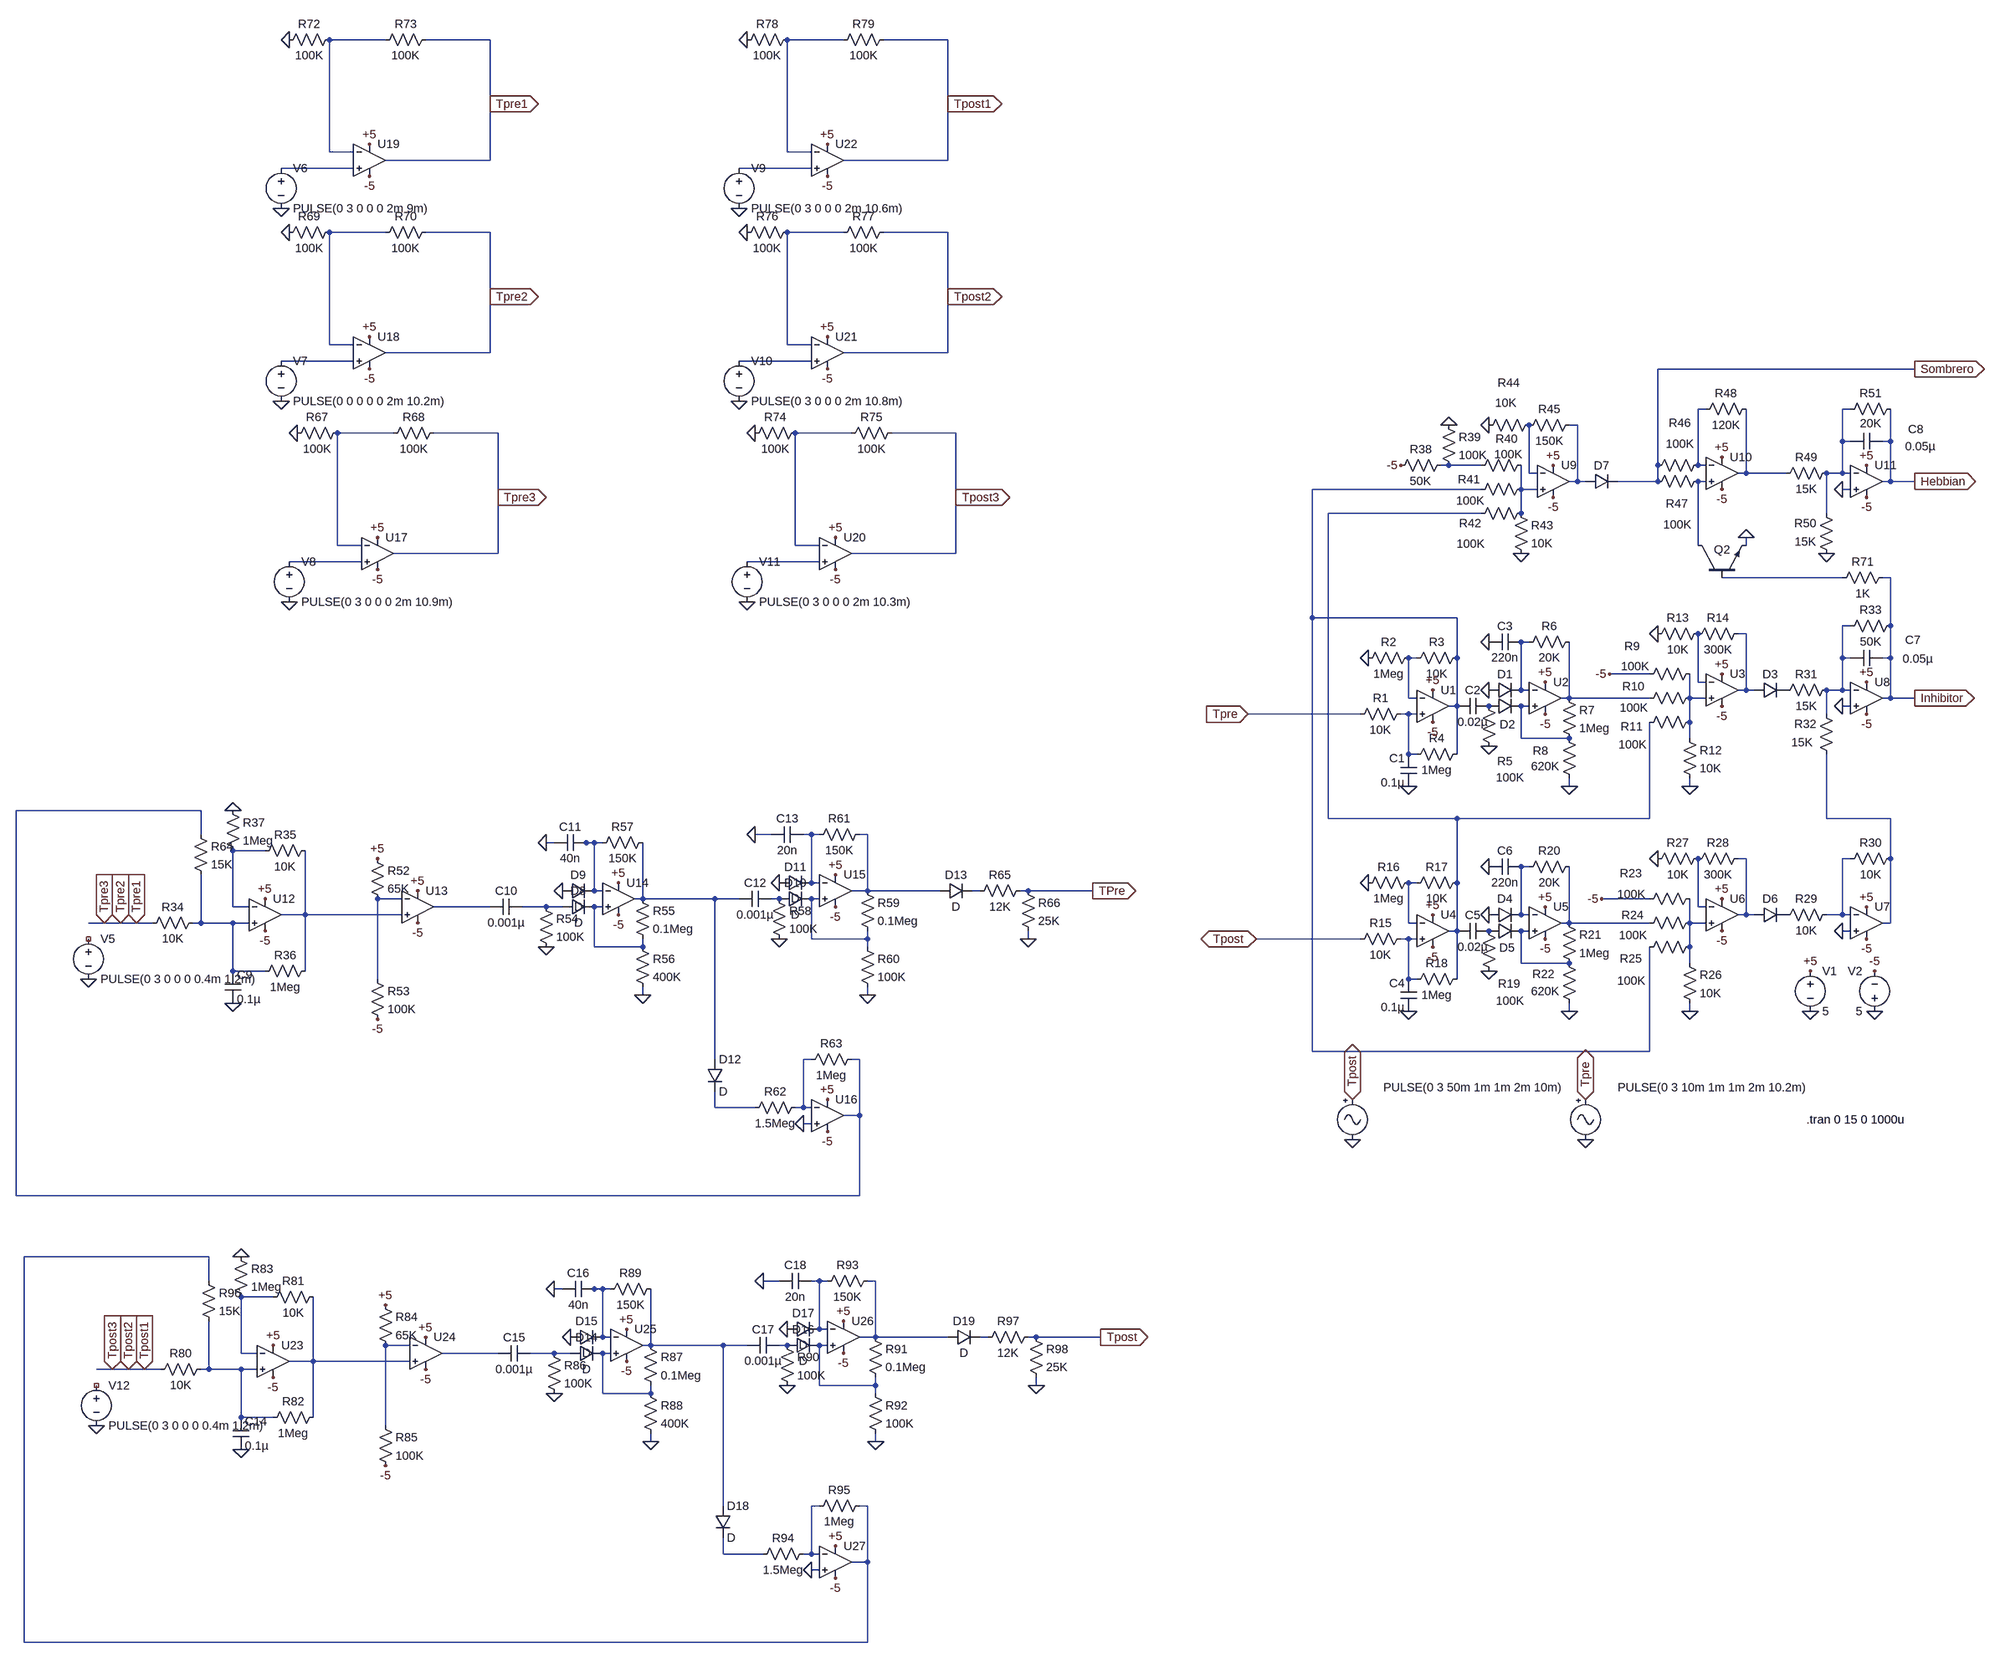
[diagram p0: schematic Last-3e_COMMON.asc]
Last-3e_COMMON.asc, the LTspice schematic file:
Version 4
SHEET 1 2784 1988
WIRE -2000 -1328 -2112 -1328
WIRE -1792 -1328 -1920 -1328
WIRE -1088 -1328 -1200 -1328
WIRE -880 -1328 -1008 -1328
WIRE -1792 -1200 -1792 -1328
WIRE -880 -1200 -880 -1328
WIRE -2112 -1104 -2112 -1328
WIRE -2064 -1104 -2112 -1104
WIRE -1200 -1104 -1200 -1328
WIRE -1152 -1104 -1200 -1104
WIRE -1792 -1088 -1792 -1200
WIRE -1792 -1088 -2000 -1088
WIRE -880 -1088 -880 -1200
WIRE -880 -1088 -1088 -1088
WIRE -2064 -1072 -2208 -1072
WIRE -1152 -1072 -1296 -1072
WIRE -2000 -944 -2112 -944
WIRE -1792 -944 -1920 -944
WIRE -1088 -944 -1200 -944
WIRE -880 -944 -1008 -944
WIRE -1792 -816 -1792 -944
WIRE -880 -816 -880 -944
WIRE -2112 -720 -2112 -944
WIRE -2064 -720 -2112 -720
WIRE -1200 -720 -1200 -944
WIRE -1152 -720 -1200 -720
WIRE -1792 -704 -1792 -816
WIRE -1792 -704 -2000 -704
WIRE -880 -704 -880 -816
WIRE -880 -704 -1088 -704
WIRE -2064 -688 -2208 -688
WIRE -1152 -688 -1296 -688
WIRE 1184 -672 672 -672
WIRE 768 -592 752 -592
WIRE 1056 -592 1040 -592
WIRE 512 -560 496 -560
WIRE -1984 -544 -2096 -544
WIRE -1776 -544 -1904 -544
WIRE -1072 -544 -1184 -544
WIRE -864 -544 -992 -544
WIRE 1040 -528 1040 -592
WIRE 1056 -528 1040 -528
WIRE 1136 -528 1136 -592
WIRE 1136 -528 1120 -528
WIRE 256 -480 240 -480
WIRE 320 -480 256 -480
WIRE 672 -480 672 -672
WIRE 752 -480 752 -592
WIRE 768 -480 752 -480
WIRE 416 -464 416 -560
WIRE 432 -464 416 -464
WIRE 848 -464 848 -592
WIRE 848 -464 832 -464
WIRE 928 -464 848 -464
WIRE 1040 -464 1040 -528
WIRE 1040 -464 1008 -464
WIRE 1056 -464 1040 -464
WIRE 512 -448 512 -560
WIRE 512 -448 496 -448
WIRE 528 -448 512 -448
WIRE 672 -448 672 -480
WIRE 672 -448 592 -448
WIRE 768 -448 752 -448
WIRE 1136 -448 1136 -528
WIRE 1136 -448 1120 -448
WIRE 1184 -448 1136 -448
WIRE 320 -432 -16 -432
WIRE 400 -432 400 -480
WIRE 432 -432 400 -432
WIRE 1056 -432 1040 -432
WIRE -1776 -416 -1776 -544
WIRE -864 -416 -864 -544
WIRE 320 -384 16 -384
WIRE 400 -384 400 -432
WIRE 1008 -384 1008 -464
WIRE -2096 -320 -2096 -544
WIRE -2048 -320 -2096 -320
WIRE -1184 -320 -1184 -544
WIRE -1136 -320 -1184 -320
WIRE 752 -320 752 -448
WIRE 848 -320 848 -336
WIRE -1776 -304 -1776 -416
WIRE -1776 -304 -1984 -304
WIRE -864 -304 -864 -416
WIRE -864 -304 -1072 -304
WIRE -2048 -288 -2192 -288
WIRE -1136 -288 -1280 -288
WIRE 1040 -256 800 -256
WIRE 1136 -256 1120 -256
WIRE -16 -176 -16 -432
WIRE 272 -176 -16 -176
WIRE 1056 -160 1040 -160
WIRE 1136 -160 1136 -256
WIRE 848 -144 832 -144
WIRE 416 -128 400 -128
WIRE 192 -96 176 -96
WIRE 272 -96 272 -176
WIRE 1040 -96 1040 -160
WIRE 1056 -96 1040 -96
WIRE 1136 -96 1136 -160
WIRE 1136 -96 1120 -96
WIRE 656 -64 576 -64
WIRE 752 -48 752 -144
WIRE 768 -48 752 -48
WIRE 400 -32 400 -128
WIRE 416 -32 400 -32
WIRE 848 -32 848 -144
WIRE 848 -32 832 -32
WIRE 864 -32 848 -32
WIRE 1040 -32 1040 -96
WIRE 1040 -32 1008 -32
WIRE 1056 -32 1040 -32
WIRE 176 -16 176 -96
WIRE 192 -16 176 -16
WIRE 496 -16 496 -128
WIRE 496 -16 480 -16
WIRE 656 -16 496 -16
WIRE 736 -16 736 -64
WIRE 768 -16 736 -16
WIRE 1136 -16 1136 -96
WIRE 1136 -16 1120 -16
WIRE 1184 -16 1136 -16
WIRE 272 0 272 -96
WIRE 272 0 256 0
WIRE 416 0 400 0
WIRE 1056 0 1040 0
WIRE 80 16 -224 16
WIRE 176 16 160 16
WIRE 192 16 176 16
WIRE 1008 16 1008 -32
WIRE 736 32 736 -16
WIRE 400 64 400 0
WIRE 496 64 400 64
WIRE 736 64 736 32
WIRE 176 96 176 16
WIRE 192 96 176 96
WIRE 272 96 272 0
WIRE 496 160 496 144
WIRE 736 160 736 144
WIRE -2368 208 -2736 208
WIRE 16 224 16 -384
WIRE 272 224 16 224
WIRE 656 224 656 32
WIRE 656 224 272 224
WIRE 1008 224 1008 96
WIRE 1136 224 1008 224
WIRE -2368 256 -2368 208
WIRE -1232 256 -1264 256
WIRE -1152 256 -1168 256
WIRE -1136 256 -1152 256
WIRE -1040 256 -1056 256
WIRE -1664 272 -1680 272
WIRE -1600 272 -1616 272
WIRE -1584 272 -1600 272
WIRE -1568 272 -1584 272
WIRE -2240 288 -2304 288
WIRE 848 304 832 304
WIRE 1056 304 1040 304
WIRE 1136 304 1136 224
WIRE 416 320 400 320
WIRE -1152 352 -1152 256
WIRE -1136 352 -1152 352
WIRE 192 352 176 352
WIRE 272 352 272 224
WIRE -1584 368 -1584 272
WIRE -1568 368 -1584 368
WIRE -1040 368 -1040 256
WIRE -1040 368 -1072 368
WIRE -896 368 -1040 368
WIRE -816 368 -832 368
WIRE -720 368 -736 368
WIRE -592 368 -720 368
WIRE -1968 384 -2016 384
WIRE -1488 384 -1488 272
WIRE -1488 384 -1504 384
WIRE -1344 384 -1488 384
WIRE -1296 384 -1344 384
WIRE -1216 384 -1232 384
WIRE -1136 384 -1152 384
WIRE 656 384 560 384
WIRE -2304 400 -2304 288
WIRE -2272 400 -2304 400
WIRE -1792 400 -1904 400
WIRE -1680 400 -1728 400
WIRE -1648 400 -1680 400
WIRE -1568 400 -1584 400
WIRE 752 400 752 304
WIRE 768 400 752 400
WIRE -2160 416 -2160 288
WIRE -2160 416 -2208 416
WIRE -1968 416 -2160 416
WIRE 400 416 400 320
WIRE 416 416 400 416
WIRE 848 416 848 304
WIRE 848 416 832 416
WIRE 864 416 848 416
WIRE 1040 416 1040 304
WIRE 1040 416 1008 416
WIRE 1056 416 1040 416
WIRE -2560 432 -2592 432
WIRE -2528 432 -2560 432
WIRE -2496 432 -2528 432
WIRE -2464 432 -2496 432
WIRE -2368 432 -2368 336
WIRE -2368 432 -2384 432
WIRE -2304 432 -2368 432
WIRE -2272 432 -2304 432
WIRE 176 432 176 352
WIRE 192 432 176 432
WIRE 496 432 496 320
WIRE 496 432 480 432
WIRE 656 432 496 432
WIRE 736 432 736 384
WIRE 768 432 736 432
WIRE 1136 432 1136 304
WIRE 1136 432 1120 432
WIRE 272 448 272 352
WIRE 272 448 256 448
WIRE 416 448 400 448
WIRE 1056 448 1040 448
WIRE -1152 464 -1152 384
WIRE -1040 464 -1040 448
WIRE -1040 464 -1152 464
WIRE -720 464 -720 448
WIRE 80 464 -208 464
WIRE 176 464 160 464
WIRE 192 464 176 464
WIRE -1584 480 -1584 400
WIRE -1488 480 -1488 464
WIRE -1488 480 -1584 480
WIRE -1040 480 -1040 464
WIRE 736 480 736 432
WIRE 400 512 400 448
WIRE 496 512 400 512
WIRE 736 512 736 480
WIRE -2304 528 -2304 432
WIRE -2240 528 -2304 528
WIRE -2160 528 -2160 416
WIRE -2016 544 -2016 384
WIRE 176 544 176 464
WIRE 192 544 176 544
WIRE 272 544 272 448
WIRE -1488 576 -1488 560
WIRE -1040 576 -1040 560
WIRE 496 608 496 592
WIRE 736 608 736 592
WIRE -16 688 -16 -176
WIRE 656 688 656 480
WIRE 656 688 -16 688
WIRE -1344 704 -1344 384
WIRE -1152 704 -1168 704
WIRE -1056 704 -1072 704
WIRE -1344 800 -1344 768
WIRE -1264 800 -1344 800
WIRE -1168 800 -1168 704
WIRE -1168 800 -1184 800
WIRE -1152 800 -1168 800
WIRE -1056 816 -1056 704
WIRE -1056 816 -1088 816
WIRE -1152 832 -1168 832
WIRE -2736 976 -2736 208
WIRE -1056 976 -1056 816
WIRE -1056 976 -2736 976
WIRE -2352 1216 -2720 1216
WIRE -2352 1264 -2352 1216
WIRE -1216 1264 -1248 1264
WIRE -1136 1264 -1152 1264
WIRE -1120 1264 -1136 1264
WIRE -1024 1264 -1040 1264
WIRE -1648 1280 -1664 1280
WIRE -1584 1280 -1600 1280
WIRE -1568 1280 -1584 1280
WIRE -1552 1280 -1568 1280
WIRE -2224 1296 -2288 1296
WIRE -1136 1360 -1136 1264
WIRE -1120 1360 -1136 1360
WIRE -1568 1376 -1568 1280
WIRE -1552 1376 -1568 1376
WIRE -1024 1376 -1024 1264
WIRE -1024 1376 -1056 1376
WIRE -880 1376 -1024 1376
WIRE -800 1376 -816 1376
WIRE -704 1376 -720 1376
WIRE -576 1376 -704 1376
WIRE -1952 1392 -2000 1392
WIRE -1472 1392 -1472 1280
WIRE -1472 1392 -1488 1392
WIRE -1328 1392 -1472 1392
WIRE -1280 1392 -1328 1392
WIRE -1200 1392 -1216 1392
WIRE -1120 1392 -1136 1392
WIRE -2288 1408 -2288 1296
WIRE -2256 1408 -2288 1408
WIRE -1776 1408 -1888 1408
WIRE -1664 1408 -1712 1408
WIRE -1632 1408 -1664 1408
WIRE -1552 1408 -1568 1408
WIRE -2144 1424 -2144 1296
WIRE -2144 1424 -2192 1424
WIRE -1952 1424 -2144 1424
WIRE -2544 1440 -2576 1440
WIRE -2512 1440 -2544 1440
WIRE -2480 1440 -2512 1440
WIRE -2448 1440 -2480 1440
WIRE -2352 1440 -2352 1344
WIRE -2352 1440 -2368 1440
WIRE -2288 1440 -2352 1440
WIRE -2256 1440 -2288 1440
WIRE -1136 1472 -1136 1392
WIRE -1024 1472 -1024 1456
WIRE -1024 1472 -1136 1472
WIRE -704 1472 -704 1456
WIRE -1568 1488 -1568 1408
WIRE -1472 1488 -1472 1472
WIRE -1472 1488 -1568 1488
WIRE -1024 1488 -1024 1472
WIRE -2288 1536 -2288 1440
WIRE -2224 1536 -2288 1536
WIRE -2144 1536 -2144 1424
WIRE -2000 1552 -2000 1392
WIRE -1472 1584 -1472 1568
WIRE -1024 1584 -1024 1568
WIRE -1328 1712 -1328 1392
WIRE -1136 1712 -1152 1712
WIRE -1040 1712 -1056 1712
WIRE -1328 1808 -1328 1776
WIRE -1248 1808 -1328 1808
WIRE -1152 1808 -1152 1712
WIRE -1152 1808 -1168 1808
WIRE -1136 1808 -1152 1808
WIRE -1040 1824 -1040 1712
WIRE -1040 1824 -1072 1824
WIRE -1136 1840 -1152 1840
WIRE -2720 1984 -2720 1216
WIRE -1040 1984 -1040 1824
WIRE -1040 1984 -2720 1984
FLAG 800 -64 +5
FLAG 800 0 -5
FLAG 528 864 0
FLAG 64 864 0
FLAG 224 -32 +5
FLAG 224 32 -5
FLAG 448 -48 +5
FLAG 448 16 -5
FLAG 336 -32 0
FLAG 336 -128 0
FLAG 336 80 0
FLAG 672 -144 0
FLAG 576 -64 -5
FLAG 448 400 +5
FLAG 448 464 -5
FLAG 336 416 0
FLAG 336 320 0
FLAG 336 528 0
FLAG 496 608 0
FLAG 496 160 0
FLAG 800 384 +5
FLAG 800 448 -5
FLAG 672 304 0
FLAG 560 384 -5
FLAG 176 160 0
FLAG 96 -96 0
FLAG 224 416 +5
FLAG 224 480 -5
FLAG 176 608 0
FLAG 96 352 0
FLAG 1088 -48 +5
FLAG 1088 16 -5
FLAG 1088 400 +5
FLAG 1088 464 -5
FLAG 1040 448 0
FLAG 1040 0 0
FLAG 736 160 0
FLAG 736 608 0
FLAG 1184 -16 Inhibitor
IOPIN 1184 -16 Out
FLAG 464 -480 +5
FLAG 464 -416 -5
FLAG 336 -560 0
FLAG 256 -560 0
FLAG 800 -496 +5
FLAG 800 -432 -5
FLAG 160 -480 -5
FLAG 1088 -480 +5
FLAG 1088 -416 -5
FLAG 1040 -432 0
FLAG 1008 -304 0
FLAG 848 -336 0
FLAG 1184 -448 Hebbian
IOPIN 1184 -448 Out
FLAG 1184 -672 Sombrero
IOPIN 1184 -672 Out
FLAG 976 608 0
FLAG 1104 608 0
FLAG 1104 528 -5
FLAG 976 528 +5
FLAG -208 464 Tpost
IOPIN -208 464 BiDir
FLAG 64 784 Tpost
IOPIN 64 784 BiDir
FLAG 528 784 Tpre
IOPIN 528 784 BiDir
FLAG 400 -304 0
FLAG -2304 208 0
FLAG -2304 592 0
FLAG -1680 480 0
FLAG -1488 576 0
FLAG -1680 272 0
FLAG -1648 368 0
FLAG -1216 464 0
FLAG -1040 576 0
FLAG -1264 256 0
FLAG -1216 352 0
FLAG -1168 832 0
FLAG -2592 544 0
FLAG -2240 384 +5
FLAG -1936 368 +5
FLAG -1536 352 +5
FLAG -1104 336 +5
FLAG -1120 784 +5
FLAG -720 464 0
FLAG -592 368 TPre
IOPIN -592 368 Out
FLAG -1936 432 -5
FLAG -2240 448 -5
FLAG -1536 416 -5
FLAG -1104 400 -5
FLAG -1120 848 -5
FLAG -2016 624 -5
FLAG -2016 304 +5
FLAG -2016 -336 +5
FLAG -2016 -272 -5
FLAG -2176 -544 0
FLAG -1776 -416 Tpre3
IOPIN -1776 -416 Out
FLAG -2032 -736 +5
FLAG -2032 -672 -5
FLAG -2192 -944 0
FLAG -1792 -816 Tpre2
IOPIN -1792 -816 Out
FLAG -2032 -1120 +5
FLAG -2032 -1056 -5
FLAG -2192 -1328 0
FLAG -1792 -1200 Tpre1
IOPIN -1792 -1200 Out
FLAG -2528 432 Tpre2
IOPIN -2528 432 In
FLAG -2496 432 Tpre1
IOPIN -2496 432 In
FLAG -2560 432 Tpre3
IOPIN -2560 432 In
FLAG -224 16 Tpre
IOPIN -224 16 In
FLAG -1104 -336 +5
FLAG -1104 -272 -5
FLAG -1264 -544 0
FLAG -864 -416 Tpost3
IOPIN -864 -416 Out
FLAG -1120 -736 +5
FLAG -1120 -672 -5
FLAG -1280 -944 0
FLAG -880 -816 Tpost2
IOPIN -880 -816 Out
FLAG -1120 -1120 +5
FLAG -1120 -1056 -5
FLAG -1280 -1328 0
FLAG -880 -1200 Tpost1
IOPIN -880 -1200 Out
FLAG -2544 1440 Tpost3
IOPIN -2544 1440 In
FLAG -2512 1440 Tpost2
IOPIN -2512 1440 In
FLAG -2480 1440 Tpost1
IOPIN -2480 1440 In
FLAG -2208 -992 0
FLAG -2208 -608 0
FLAG -2192 -208 0
FLAG -1296 -992 0
FLAG -1296 -608 0
FLAG -1280 -208 0
FLAG -2288 1216 0
FLAG -2288 1600 0
FLAG -1664 1488 0
FLAG -1472 1584 0
FLAG -1664 1280 0
FLAG -1632 1376 0
FLAG -1200 1472 0
FLAG -1024 1584 0
FLAG -1248 1264 0
FLAG -1200 1360 0
FLAG -1152 1840 0
FLAG -2576 1552 0
FLAG -2224 1392 +5
FLAG -1920 1376 +5
FLAG -1520 1360 +5
FLAG -1088 1344 +5
FLAG -1104 1792 +5
FLAG -704 1472 0
FLAG -576 1376 Tpost
IOPIN -576 1376 Out
FLAG -1920 1440 -5
FLAG -2224 1456 -5
FLAG -1520 1424 -5
FLAG -1088 1408 -5
FLAG -1104 1856 -5
FLAG -2000 1632 -5
FLAG -2000 1312 +5
SYMBOL Opamps\\UniversalOpamp2 800 -32 R0
SYMATTR InstName U3
SYMBOL res 848 -160 R90
WINDOW 0 0 56 VBottom 2
WINDOW 3 32 56 VTop 2
SYMATTR InstName R14
SYMATTR Value 300K
SYMBOL res 720 48 R0
SYMATTR InstName R12
SYMATTR Value 10K
SYMBOL res 752 -32 R90
WINDOW 0 8 128 VBottom 2
WINDOW 3 20 127 VTop 2
SYMATTR InstName R10
SYMATTR Value 100K
SYMBOL Opamps\\UniversalOpamp2 224 0 R0
SYMATTR InstName U1
SYMBOL cap 192 160 R180
WINDOW 0 24 56 Left 2
WINDOW 3 24 8 Left 2
SYMATTR InstName C1
SYMATTR Value 0.1µ
SYMBOL res 176 0 R90
WINDOW 0 0 56 VBottom 2
WINDOW 3 32 56 VTop 2
SYMATTR InstName R1
SYMATTR Value 10K
SYMBOL res 176 448 R90
WINDOW 0 0 56 VBottom 2
WINDOW 3 32 56 VTop 2
SYMATTR InstName R15
SYMATTR Value 10K
SYMBOL res 288 -112 R90
WINDOW 0 0 56 VBottom 2
WINDOW 3 32 56 VTop 2
SYMATTR InstName R3
SYMATTR Value 10K
SYMBOL res 752 16 R90
WINDOW 0 40 132 VBottom 2
WINDOW 3 45 130 VTop 2
SYMATTR InstName R11
SYMATTR Value 100K
SYMBOL Opamps\\UniversalOpamp2 448 -16 R0
SYMATTR InstName U2
SYMBOL diode 336 -16 R270
WINDOW 0 32 32 VTop 2
WINDOW 3 0 32 Invisible 2
SYMATTR InstName D1
SYMBOL diode 336 16 R270
WINDOW 0 -36 37 VTop 2
WINDOW 3 0 32 Invisible 2
SYMATTR InstName D2
SYMBOL res 480 -32 R0
SYMATTR InstName R7
SYMATTR Value 1Meg
SYMBOL res 512 160 R180
WINDOW 0 58 71 Left 2
WINDOW 3 36 40 Left 2
SYMATTR InstName R8
SYMATTR Value 620K
SYMBOL res 320 -16 R0
WINDOW 0 32 126 Left 2
WINDOW 3 30 158 Left 2
SYMATTR InstName R5
SYMATTR Value 100K
SYMBOL cap 336 -16 R90
WINDOW 0 0 32 VBottom 2
WINDOW 3 32 32 VTop 2
SYMATTR InstName C2
SYMATTR Value 0.02µ
SYMBOL res 512 -144 R90
WINDOW 0 0 56 VBottom 2
WINDOW 3 32 56 VTop 2
SYMATTR InstName R6
SYMATTR Value 20K
SYMBOL cap 400 -144 R90
WINDOW 0 0 32 VBottom 2
WINDOW 3 32 32 VTop 2
SYMATTR InstName C3
SYMATTR Value 220n
SYMBOL res 656 -128 R270
WINDOW 0 32 56 VTop 2
WINDOW 3 0 56 VBottom 2
SYMATTR InstName R13
SYMATTR Value 10K
SYMBOL diode 864 -16 R270
WINDOW 0 32 32 VTop 2
WINDOW 3 0 32 Invisible 2
SYMATTR InstName D3
SYMBOL res 752 -80 R90
WINDOW 0 -24 131 VBottom 2
WINDOW 3 -15 125 VTop 2
SYMATTR InstName R9
SYMATTR Value 100K
SYMBOL Opamps\\UniversalOpamp2 448 432 R0
SYMATTR InstName U5
SYMBOL diode 336 432 R270
WINDOW 0 32 32 VTop 2
WINDOW 3 0 32 Invisible 2
SYMATTR InstName D4
SYMBOL diode 336 464 R270
WINDOW 0 -33 36 VTop 2
WINDOW 3 0 32 Invisible 2
SYMATTR InstName D5
SYMBOL res 480 416 R0
SYMATTR InstName R21
SYMATTR Value 1Meg
SYMBOL res 512 608 R180
WINDOW 0 45 74 Left 2
WINDOW 3 36 40 Left 2
SYMATTR InstName R22
SYMATTR Value 620K
SYMBOL res 320 432 R0
WINDOW 0 34 121 Left 2
WINDOW 3 30 155 Left 2
SYMATTR InstName R19
SYMATTR Value 100K
SYMBOL res 512 304 R90
WINDOW 0 0 56 VBottom 2
WINDOW 3 32 56 VTop 2
SYMATTR InstName R20
SYMATTR Value 20K
SYMBOL cap 400 304 R90
WINDOW 0 0 32 VBottom 2
WINDOW 3 32 32 VTop 2
SYMATTR InstName C6
SYMATTR Value 220n
SYMBOL cap 336 432 R90
WINDOW 0 0 32 VBottom 2
WINDOW 3 32 32 VTop 2
SYMATTR InstName C5
SYMATTR Value 0.02µ
SYMBOL Opamps\\UniversalOpamp2 800 416 R0
SYMATTR InstName U6
SYMBOL res 848 288 R90
WINDOW 0 0 56 VBottom 2
WINDOW 3 32 56 VTop 2
SYMATTR InstName R28
SYMATTR Value 300K
SYMBOL res 720 496 R0
SYMATTR InstName R26
SYMATTR Value 10K
SYMBOL res 752 416 R90
WINDOW 0 16 130 VBottom 2
WINDOW 3 25 129 VTop 2
SYMATTR InstName R24
SYMATTR Value 100K
SYMBOL res 752 464 R90
WINDOW 0 55 133 VBottom 2
WINDOW 3 68 132 VTop 2
SYMATTR InstName R25
SYMATTR Value 100K
SYMBOL res 656 320 R270
WINDOW 0 32 56 VTop 2
WINDOW 3 0 56 VBottom 2
SYMATTR InstName R27
SYMATTR Value 10K
SYMBOL diode 864 432 R270
WINDOW 0 32 32 VTop 2
WINDOW 3 0 32 Invisible 2
SYMATTR InstName D6
SYMBOL res 752 368 R90
WINDOW 0 -19 133 VBottom 2
WINDOW 3 -9 132 VTop 2
SYMATTR InstName R23
SYMATTR Value 100K
SYMBOL res 1152 -176 R90
WINDOW 0 0 56 VBottom 2
WINDOW 3 32 56 VTop 2
SYMATTR InstName R33
SYMATTR Value 50K
SYMBOL res 1024 -48 R90
WINDOW 0 0 56 VBottom 2
WINDOW 3 32 56 VTop 2
SYMATTR InstName R31
SYMATTR Value 15K
SYMBOL res 1024 112 R180
WINDOW 0 36 76 Left 2
WINDOW 3 43 40 Left 2
SYMATTR InstName R32
SYMATTR Value 15K
SYMBOL res 288 80 R90
WINDOW 0 0 56 VBottom 2
WINDOW 3 32 56 VTop 2
SYMATTR InstName R4
SYMATTR Value 1Meg
SYMBOL res 192 -112 R90
WINDOW 0 0 56 VBottom 2
WINDOW 3 32 56 VTop 2
SYMATTR InstName R2
SYMATTR Value 1Meg
SYMBOL Opamps\\UniversalOpamp2 224 448 R0
SYMATTR InstName U4
SYMBOL cap 192 608 R180
WINDOW 0 24 56 Left 2
WINDOW 3 24 8 Left 2
SYMATTR InstName C4
SYMATTR Value 0.1µ
SYMBOL res 288 336 R90
WINDOW 0 0 56 VBottom 2
WINDOW 3 32 56 VTop 2
SYMATTR InstName R17
SYMATTR Value 10K
SYMBOL res 288 528 R90
WINDOW 0 0 56 VBottom 2
WINDOW 3 32 56 VTop 2
SYMATTR InstName R18
SYMATTR Value 1Meg
SYMBOL res 192 336 R90
WINDOW 0 0 56 VBottom 2
WINDOW 3 32 56 VTop 2
SYMATTR InstName R16
SYMATTR Value 1Meg
SYMBOL Opamps\\UniversalOpamp2 1088 -16 R0
SYMATTR InstName U8
SYMBOL res 1152 288 R90
WINDOW 0 0 56 VBottom 2
WINDOW 3 32 56 VTop 2
SYMATTR InstName R30
SYMATTR Value 10K
SYMBOL Opamps\\UniversalOpamp2 1088 432 R0
SYMATTR InstName U7
SYMBOL res 1024 400 R90
WINDOW 0 0 56 VBottom 2
WINDOW 3 32 56 VTop 2
SYMATTR InstName R29
SYMATTR Value 10K
SYMBOL cap 1120 -112 R90
WINDOW 0 -4 -60 VBottom 2
WINDOW 3 2 -70 VTop 2
SYMATTR InstName C7
SYMATTR Value 0.05µ
SYMBOL Opamps\\UniversalOpamp2 464 -448 R0
SYMATTR InstName U9
SYMBOL res 512 -576 R90
WINDOW 0 0 56 VBottom 2
WINDOW 3 32 56 VTop 2
SYMATTR InstName R45
SYMATTR Value 150K
SYMBOL res 384 -400 R0
SYMATTR InstName R43
SYMATTR Value 10K
SYMBOL res 416 -448 R90
WINDOW 0 12 120 VBottom 2
WINDOW 3 23 117 VTop 2
SYMATTR InstName R41
SYMATTR Value 100K
SYMBOL res 320 -544 R270
WINDOW 0 85 55 VTop 2
WINDOW 3 76 50 VBottom 2
SYMATTR InstName R44
SYMATTR Value 10K
SYMBOL res 416 -496 R90
WINDOW 0 -21 45 VBottom 2
WINDOW 3 -21 41 VTop 2
SYMATTR InstName R40
SYMATTR Value 100K
SYMBOL res 240 -576 R0
SYMATTR InstName R39
SYMATTR Value 100K
SYMBOL res 256 -496 R90
WINDOW 0 0 56 VBottom 2
WINDOW 3 32 56 VTop 2
SYMATTR InstName R38
SYMATTR Value 50K
SYMBOL diode 528 -432 R270
WINDOW 0 32 32 VTop 2
WINDOW 3 0 32 Invisible 2
SYMATTR InstName D7
SYMBOL res 864 -608 R90
WINDOW 0 0 56 VBottom 2
WINDOW 3 32 56 VTop 2
SYMATTR InstName R48
SYMATTR Value 120K
SYMBOL Opamps\\UniversalOpamp2 800 -464 R0
SYMATTR InstName U10
SYMBOL res 768 -496 R90
WINDOW 0 -53 52 VBottom 2
WINDOW 3 -42 52 VTop 2
SYMATTR InstName R46
SYMATTR Value 100K
SYMBOL res 768 -464 R90
WINDOW 0 76 58 VBottom 2
WINDOW 3 87 57 VTop 2
SYMATTR InstName R47
SYMATTR Value 100K
SYMBOL npn 752 -256 R270
WINDOW 0 56 32 VRight 2
WINDOW 3 56 68 Invisible 2
SYMATTR InstName Q2
SYMBOL res 1152 -608 R90
WINDOW 0 0 56 VBottom 2
WINDOW 3 60 56 VBottom 2
SYMATTR InstName R51
SYMATTR Value 20K
SYMBOL res 1024 -480 R90
WINDOW 0 0 56 VBottom 2
WINDOW 3 32 56 VTop 2
SYMATTR InstName R49
SYMATTR Value 15K
SYMBOL res 1024 -288 R180
WINDOW 0 36 76 Left 2
WINDOW 3 36 40 Left 2
SYMATTR InstName R50
SYMATTR Value 15K
SYMBOL Opamps\\UniversalOpamp2 1088 -448 R0
SYMATTR InstName U11
SYMBOL cap 1120 -544 R90
WINDOW 0 8 -66 VBottom 2
WINDOW 3 11 -75 VTop 2
SYMATTR InstName C8
SYMATTR Value 0.05µ
SYMBOL res 1024 -240 R270
WINDOW 0 32 56 VTop 2
WINDOW 3 0 56 VBottom 2
SYMATTR InstName R71
SYMATTR Value 1K
SYMBOL voltage 976 512 R0
WINDOW 123 0 0 Left 2
WINDOW 39 0 0 Left 2
SYMATTR InstName V1
SYMATTR Value 5
SYMBOL voltage 1104 624 R180
WINDOW 0 24 96 Left 2
WINDOW 3 24 16 Left 2
WINDOW 123 0 0 Left 2
WINDOW 39 0 0 Left 2
SYMATTR InstName V2
SYMATTR Value 5
SYMBOL Misc\\signal 64 768 R0
WINDOW 0 24 16 Invisible 2
WINDOW 3 62 -8 Left 2
WINDOW 123 0 0 Left 2
WINDOW 39 0 0 Left 2
SYMATTR InstName V3
SYMATTR Value PULSE(0 3 50m 1m 1m 2m 10m)
SYMBOL Misc\\signal 528 768 R0
WINDOW 0 24 16 Invisible 2
WINDOW 3 64 -8 Left 2
WINDOW 123 0 0 Left 2
WINDOW 39 0 0 Left 2
SYMATTR InstName V4
SYMATTR Value PULSE(0 3 10m 1m 1m 2m 10.2m)
SYMBOL res 416 -400 R90
WINDOW 0 51 117 VBottom 2
WINDOW 3 61 116 VTop 2
SYMATTR InstName R42
SYMATTR Value 100K
SYMBOL voltage -2592 448 R0
WINDOW 123 0 0 Left 0
WINDOW 39 0 0 Left 0
SYMATTR InstName V5
SYMATTR Value PULSE(0 3 0 0 0 0.4m 1.2m)
SYMBOL res -2368 416 R90
WINDOW 0 0 56 VBottom 2
WINDOW 3 32 56 VTop 2
SYMATTR InstName R34
SYMATTR Value 10K
SYMBOL Opamps\\UniversalOpamp2 -2240 416 R0
SYMATTR InstName U12
SYMBOL res -2144 272 R90
WINDOW 0 0 56 VBottom 2
WINDOW 3 32 56 VTop 2
SYMATTR InstName R35
SYMATTR Value 10K
SYMBOL res -2144 512 R90
WINDOW 0 0 56 VBottom 2
WINDOW 3 32 56 VTop 2
SYMATTR InstName R36
SYMATTR Value 1Meg
SYMBOL res -2320 192 R0
SYMATTR InstName R37
SYMATTR Value 1Meg
SYMBOL cap -2320 528 R0
SYMATTR InstName C9
SYMATTR Value 0.1µ
SYMBOL Opamps\\UniversalOpamp2 -1936 400 R0
SYMATTR InstName U13
SYMBOL res -2032 288 R0
SYMATTR InstName R52
SYMATTR Value 65K
SYMBOL res -2032 528 R0
SYMATTR InstName R53
SYMATTR Value 100K
SYMBOL cap -1728 384 R90
WINDOW 0 0 32 VBottom 2
WINDOW 3 32 32 VTop 2
SYMATTR InstName C10
SYMATTR Value 0.001µ
SYMBOL res -1696 384 R0
SYMATTR InstName R54
SYMATTR Value 100K
SYMBOL diode -1648 416 R270
WINDOW 0 32 32 VTop 2
WINDOW 3 0 32 VBottom 2
SYMATTR InstName D8
SYMBOL Opamps\\UniversalOpamp2 -1536 384 R0
SYMATTR InstName U14
SYMBOL res -1504 368 R0
SYMATTR InstName R55
SYMATTR Value 0.1Meg
SYMBOL res -1504 464 R0
SYMATTR InstName R56
SYMATTR Value 400K
SYMBOL res -1472 256 R90
WINDOW 0 0 56 VBottom 2
WINDOW 3 32 56 VTop 2
SYMATTR InstName R57
SYMATTR Value 150K
SYMBOL cap -1600 256 R90
WINDOW 0 0 32 VBottom 2
WINDOW 3 32 32 VTop 2
SYMATTR InstName C11
SYMATTR Value 40n
SYMBOL diode -1648 384 R270
WINDOW 0 32 32 VTop 2
WINDOW 3 0 32 VBottom 2
SYMATTR InstName D9
SYMBOL cap -1232 368 R90
WINDOW 0 0 32 VBottom 2
WINDOW 3 32 32 VTop 2
SYMATTR InstName C12
SYMATTR Value 0.001µ
SYMBOL diode -1216 400 R270
WINDOW 0 32 32 VTop 2
WINDOW 3 0 32 VBottom 2
SYMATTR InstName D10
SYMBOL res -1232 368 R0
SYMATTR InstName R58
SYMATTR Value 100K
SYMBOL Opamps\\UniversalOpamp2 -1104 368 R0
SYMATTR InstName U15
SYMBOL res -1056 352 R0
SYMATTR InstName R59
SYMATTR Value 0.1Meg
SYMBOL res -1056 464 R0
SYMATTR InstName R60
SYMATTR Value 100K
SYMBOL res -1040 240 R90
WINDOW 0 0 56 VBottom 2
WINDOW 3 32 56 VTop 2
SYMATTR InstName R61
SYMATTR Value 150K
SYMBOL cap -1168 240 R90
WINDOW 0 0 32 VBottom 2
WINDOW 3 32 32 VTop 2
SYMATTR InstName C13
SYMATTR Value 20n
SYMBOL diode -1216 368 R270
WINDOW 0 32 32 VTop 2
WINDOW 3 0 32 VBottom 2
SYMATTR InstName D11
SYMBOL diode -1360 704 R0
SYMATTR InstName D12
SYMBOL res -1168 784 R90
WINDOW 0 0 56 VBottom 2
WINDOW 3 32 56 VTop 2
SYMATTR InstName R62
SYMATTR Value 1.5Meg
SYMBOL Opamps\\UniversalOpamp2 -1120 816 R0
SYMATTR InstName U16
SYMBOL res -1056 688 R90
WINDOW 0 0 56 VBottom 2
WINDOW 3 32 56 VTop 2
SYMATTR InstName R63
SYMATTR Value 1Meg
SYMBOL res -2384 240 R0
SYMATTR InstName R64
SYMATTR Value 15K
SYMBOL diode -896 384 R270
WINDOW 0 32 32 VTop 2
WINDOW 3 0 32 VBottom 2
SYMATTR InstName D13
SYMBOL res -720 352 R90
WINDOW 0 0 56 VBottom 2
WINDOW 3 32 56 VTop 2
SYMATTR InstName R65
SYMATTR Value 12K
SYMBOL res -736 352 R0
SYMATTR InstName R66
SYMATTR Value 25K
SYMBOL Opamps\\UniversalOpamp2 -2016 -304 R0
SYMATTR InstName U17
SYMBOL res -2080 -560 R90
WINDOW 0 0 56 VBottom 2
WINDOW 3 32 56 VTop 2
SYMATTR InstName R67
SYMATTR Value 100K
SYMBOL res -1888 -560 R90
WINDOW 0 0 56 VBottom 2
WINDOW 3 32 56 VTop 2
SYMATTR InstName R68
SYMATTR Value 100K
SYMBOL Opamps\\UniversalOpamp2 -2032 -704 R0
SYMATTR InstName U18
SYMBOL res -2096 -960 R90
WINDOW 0 0 56 VBottom 2
WINDOW 3 32 56 VTop 2
SYMATTR InstName R69
SYMATTR Value 100K
SYMBOL res -1904 -960 R90
WINDOW 0 0 56 VBottom 2
WINDOW 3 32 56 VTop 2
SYMATTR InstName R70
SYMATTR Value 100K
SYMBOL Opamps\\UniversalOpamp2 -2032 -1088 R0
SYMATTR InstName U19
SYMBOL res -2096 -1344 R90
WINDOW 0 0 56 VBottom 2
WINDOW 3 32 56 VTop 2
SYMATTR InstName R72
SYMATTR Value 100K
SYMBOL res -1904 -1344 R90
WINDOW 0 0 56 VBottom 2
WINDOW 3 32 56 VTop 2
SYMATTR InstName R73
SYMATTR Value 100K
SYMBOL Opamps\\UniversalOpamp2 -1104 -304 R0
SYMATTR InstName U20
SYMBOL res -1168 -560 R90
WINDOW 0 0 56 VBottom 2
WINDOW 3 32 56 VTop 2
SYMATTR InstName R74
SYMATTR Value 100K
SYMBOL res -976 -560 R90
WINDOW 0 0 56 VBottom 2
WINDOW 3 32 56 VTop 2
SYMATTR InstName R75
SYMATTR Value 100K
SYMBOL Opamps\\UniversalOpamp2 -1120 -704 R0
SYMATTR InstName U21
SYMBOL res -1184 -960 R90
WINDOW 0 0 56 VBottom 2
WINDOW 3 32 56 VTop 2
SYMATTR InstName R76
SYMATTR Value 100K
SYMBOL res -992 -960 R90
WINDOW 0 0 56 VBottom 2
WINDOW 3 32 56 VTop 2
SYMATTR InstName R77
SYMATTR Value 100K
SYMBOL Opamps\\UniversalOpamp2 -1120 -1088 R0
SYMATTR InstName U22
SYMBOL res -1184 -1344 R90
WINDOW 0 0 56 VBottom 2
WINDOW 3 32 56 VTop 2
SYMATTR InstName R78
SYMATTR Value 100K
SYMBOL res -992 -1344 R90
WINDOW 0 0 56 VBottom 2
WINDOW 3 32 56 VTop 2
SYMATTR InstName R79
SYMATTR Value 100K
SYMBOL voltage -2208 -1088 R0
WINDOW 123 0 0 Left 0
WINDOW 39 0 0 Left 0
SYMATTR InstName V6
SYMATTR Value PULSE(0 3 0 0 0 2m 9m)
SYMBOL voltage -2208 -704 R0
WINDOW 123 0 0 Left 0
WINDOW 39 0 0 Left 0
SYMATTR InstName V7
SYMATTR Value PULSE(0 0 0 0 0 2m 10.2m)
SYMBOL voltage -2192 -304 R0
WINDOW 123 0 0 Left 0
WINDOW 39 0 0 Left 0
SYMATTR InstName V8
SYMATTR Value PULSE(0 3 0 0 0 2m 10.9m)
SYMBOL voltage -1296 -1088 R0
WINDOW 123 0 0 Left 0
WINDOW 39 0 0 Left 0
SYMATTR InstName V9
SYMATTR Value PULSE(0 3 0 0 0 2m 10.6m)
SYMBOL voltage -1296 -704 R0
WINDOW 123 0 0 Left 0
WINDOW 39 0 0 Left 0
SYMATTR InstName V10
SYMATTR Value PULSE(0 3 0 0 0 2m 10.8m)
SYMBOL voltage -1280 -304 R0
WINDOW 123 0 0 Left 0
WINDOW 39 0 0 Left 0
SYMATTR InstName V11
SYMATTR Value PULSE(0 3 0 0 0 2m 10.3m)
SYMBOL voltage -2576 1456 R0
WINDOW 123 0 0 Left 0
WINDOW 39 0 0 Left 0
SYMATTR InstName V12
SYMATTR Value PULSE(0 3 0 0 0 0.4m 1.2m)
SYMBOL res -2352 1424 R90
WINDOW 0 0 56 VBottom 2
WINDOW 3 32 56 VTop 2
SYMATTR InstName R80
SYMATTR Value 10K
SYMBOL Opamps\\UniversalOpamp2 -2224 1424 R0
SYMATTR InstName U23
SYMBOL res -2128 1280 R90
WINDOW 0 0 56 VBottom 2
WINDOW 3 32 56 VTop 2
SYMATTR InstName R81
SYMATTR Value 10K
SYMBOL res -2128 1520 R90
WINDOW 0 0 56 VBottom 2
WINDOW 3 32 56 VTop 2
SYMATTR InstName R82
SYMATTR Value 1Meg
SYMBOL res -2304 1200 R0
SYMATTR InstName R83
SYMATTR Value 1Meg
SYMBOL cap -2304 1536 R0
SYMATTR InstName C14
SYMATTR Value 0.1µ
SYMBOL Opamps\\UniversalOpamp2 -1920 1408 R0
SYMATTR InstName U24
SYMBOL res -2016 1296 R0
SYMATTR InstName R84
SYMATTR Value 65K
SYMBOL res -2016 1536 R0
SYMATTR InstName R85
SYMATTR Value 100K
SYMBOL cap -1712 1392 R90
WINDOW 0 0 32 VBottom 2
WINDOW 3 32 32 VTop 2
SYMATTR InstName C15
SYMATTR Value 0.001µ
SYMBOL res -1680 1392 R0
SYMATTR InstName R86
SYMATTR Value 100K
SYMBOL diode -1632 1424 R270
WINDOW 0 32 32 VTop 2
WINDOW 3 0 32 VBottom 2
SYMATTR InstName D14
SYMBOL Opamps\\UniversalOpamp2 -1520 1392 R0
SYMATTR InstName U25
SYMBOL res -1488 1376 R0
SYMATTR InstName R87
SYMATTR Value 0.1Meg
SYMBOL res -1488 1472 R0
SYMATTR InstName R88
SYMATTR Value 400K
SYMBOL res -1456 1264 R90
WINDOW 0 0 56 VBottom 2
WINDOW 3 32 56 VTop 2
SYMATTR InstName R89
SYMATTR Value 150K
SYMBOL cap -1584 1264 R90
WINDOW 0 0 32 VBottom 2
WINDOW 3 32 32 VTop 2
SYMATTR InstName C16
SYMATTR Value 40n
SYMBOL diode -1632 1392 R270
WINDOW 0 32 32 VTop 2
WINDOW 3 0 32 VBottom 2
SYMATTR InstName D15
SYMBOL cap -1216 1376 R90
WINDOW 0 0 32 VBottom 2
WINDOW 3 32 32 VTop 2
SYMATTR InstName C17
SYMATTR Value 0.001µ
SYMBOL diode -1200 1408 R270
WINDOW 0 32 32 VTop 2
WINDOW 3 0 32 VBottom 2
SYMATTR InstName D16
SYMBOL res -1216 1376 R0
SYMATTR InstName R90
SYMATTR Value 100K
SYMBOL Opamps\\UniversalOpamp2 -1088 1376 R0
SYMATTR InstName U26
SYMBOL res -1040 1360 R0
SYMATTR InstName R91
SYMATTR Value 0.1Meg
SYMBOL res -1040 1472 R0
SYMATTR InstName R92
SYMATTR Value 100K
SYMBOL res -1024 1248 R90
WINDOW 0 0 56 VBottom 2
WINDOW 3 32 56 VTop 2
SYMATTR InstName R93
SYMATTR Value 150K
SYMBOL cap -1152 1248 R90
WINDOW 0 0 32 VBottom 2
WINDOW 3 32 32 VTop 2
SYMATTR InstName C18
SYMATTR Value 20n
SYMBOL diode -1200 1376 R270
WINDOW 0 32 32 VTop 2
WINDOW 3 0 32 VBottom 2
SYMATTR InstName D17
SYMBOL diode -1344 1712 R0
SYMATTR InstName D18
SYMBOL res -1152 1792 R90
WINDOW 0 0 56 VBottom 2
WINDOW 3 32 56 VTop 2
SYMATTR InstName R94
SYMATTR Value 1.5Meg
SYMBOL Opamps\\UniversalOpamp2 -1104 1824 R0
SYMATTR InstName U27
SYMBOL res -1040 1696 R90
WINDOW 0 0 56 VBottom 2
WINDOW 3 32 56 VTop 2
SYMATTR InstName R95
SYMATTR Value 1Meg
SYMBOL res -2368 1248 R0
SYMATTR InstName R96
SYMATTR Value 15K
SYMBOL diode -880 1392 R270
WINDOW 0 32 32 VTop 2
WINDOW 3 0 32 VBottom 2
SYMATTR InstName D19
SYMBOL res -704 1360 R90
WINDOW 0 0 56 VBottom 2
WINDOW 3 32 56 VTop 2
SYMATTR InstName R97
SYMATTR Value 12K
SYMBOL res -720 1360 R0
SYMATTR InstName R98
SYMATTR Value 25K
TEXT 968 824 Left 2 !.tran 0 15 0 1000u

The netlist it stands for:
* Last-3e_COMMON.asc
XU3 N030 N028 +5 -5 N025 level.2 Avol=1Meg GBW=10Meg Slew=10Meg ilimit=25m rail=0 Vos=0 phimargin=45 en=0 enk=0 in=0 ink=0 Rin=500Meg  ; pins IN+ IN- V+ V- OUT
R14 N025 N028 300K
R12 N030 0 10K
R10 N030 N029 100K
XU1 N032 N027 +5 -5 N018 level.2 Avol=1Meg GBW=10Meg Slew=10Meg ilimit=25m rail=0 Vos=0 phimargin=45 en=0 enk=0 in=0 ink=0 Rin=500Meg  ; pins IN+ IN- V+ V- OUT
C1 0 N032 0.1µ
R1 N032 Tpre 10K
R15 N057 Tpost 10K
R3 N018 N027 10K
R11 N030 N020 100K
XU2 N031 N026 +5 -5 N029 level.2 Avol=1Meg GBW=10Meg Slew=10Meg ilimit=25m rail=0 Vos=0 phimargin=45 en=0 enk=0 in=0 ink=0 Rin=500Meg  ; pins IN+ IN- V+ V- OUT
D1 0 N026 D
D2 P001 N031 D
R7 N029 N031 1Meg
R8 0 N031 620K
R5 P001 0 100K
C2 P001 N018 0.02µ
R6 N029 N026 20K
C3 N026 0 220n
R13 0 N028 10K
D3 N025 P002 D
R9 N030 -5 100K
XU5 N056 N041 +5 -5 N054 level.2 Avol=1Meg GBW=10Meg Slew=10Meg ilimit=25m rail=0 Vos=0 phimargin=45 en=0 enk=0 in=0 ink=0 Rin=500Meg  ; pins IN+ IN- V+ V- OUT
D4 0 N041 D
D5 P003 N056 D
R21 N054 N056 1Meg
R22 0 N056 620K
R19 P003 0 100K
R20 N054 N041 20K
C6 N041 0 220n
C5 P003 N020 0.02µ
XU6 N055 N051 +5 -5 N039 level.2 Avol=1Meg GBW=10Meg Slew=10Meg ilimit=25m rail=0 Vos=0 phimargin=45 en=0 enk=0 in=0 ink=0 Rin=500Meg  ; pins IN+ IN- V+ V- OUT
R28 N039 N051 300K
R26 N055 0 10K
R24 N055 N054 100K
R25 N055 N018 100K
R27 0 N051 10K
D6 N039 P004 D
R23 N055 -5 100K
R33 Inhibitor N024 50K
R31 N024 P002 15K
R32 N034 N024 15K
R4 N018 N032 1Meg
R2 N027 0 1Meg
XU4 N057 N042 +5 -5 N020 level.2 Avol=1Meg GBW=10Meg Slew=10Meg ilimit=25m rail=0 Vos=0 phimargin=45 en=0 enk=0 in=0 ink=0 Rin=500Meg  ; pins IN+ IN- V+ V- OUT
C4 0 N057 0.1µ
R17 N020 N042 10K
R18 N020 N057 1Meg
R16 N042 0 1Meg
XU8 0 N024 +5 -5 Inhibitor level.2 Avol=1Meg GBW=10Meg Slew=10Meg ilimit=25m rail=0 Vos=0 phimargin=45 en=0 enk=0 in=0 ink=0 Rin=500Meg  ; pins IN+ IN- V+ V- OUT
R30 N034 N040 10K
XU7 0 N040 +5 -5 N034 level.2 Avol=1Meg GBW=10Meg Slew=10Meg ilimit=25m rail=0 Vos=0 phimargin=45 en=0 enk=0 in=0 ink=0 Rin=500Meg  ; pins IN+ IN- V+ V- OUT
R29 N040 P004 10K
C7 Inhibitor N024 0.05µ
XU9 N019 N015 +5 -5 N011 level.2 Avol=1Meg GBW=10Meg Slew=10Meg ilimit=25m rail=0 Vos=0 phimargin=45 en=0 enk=0 in=0 ink=0 Rin=500Meg  ; pins IN+ IN- V+ V- OUT
R45 N011 N015 150K
R43 N019 0 10K
R41 N019 N018 100K
R44 0 N015 10K
R40 N019 N014 100K
R39 0 N014 100K
R38 N014 -5 50K
D7 N011 Sombrero D
R48 N016 N009 120K
XU10 N017 N009 +5 -5 N016 level.2 Avol=1Meg GBW=10Meg Slew=10Meg ilimit=25m rail=0 Vos=0 phimargin=45 en=0 enk=0 in=0 ink=0 Rin=500Meg  ; pins IN+ IN- V+ V- OUT
R46 N009 Sombrero 100K
R47 N017 Sombrero 100K
Q2 N017 N023 0 0 NPN
R51 Hebbian N010 20K
R49 N010 N016 15K
R50 0 N010 15K
XU11 0 N010 +5 -5 Hebbian level.2 Avol=1Meg GBW=10Meg Slew=10Meg ilimit=25m rail=0 Vos=0 phimargin=45 en=0 enk=0 in=0 ink=0 Rin=500Meg  ; pins IN+ IN- V+ V- OUT
C8 Hebbian N010 0.05µ
R71 N023 Inhibitor 1K
V1 +5 0 5
V2 0 -5 5
V3 Tpost 0 PULSE(0 3 50m 1m 1m 2m 10m)
V4 Tpre 0 PULSE(0 3 10m 1m 1m 2m 10.2m)
R42 N019 N020 100K
V5 NC_01 0 PULSE(0 3 0 0 0 0.4m 1.2m)
R34 N053 Tpre1 10K
XU12 N053 N038 +5 -5 N052 level.2 Avol=1Meg GBW=10Meg Slew=10Meg ilimit=25m rail=0 Vos=0 phimargin=45 en=0 enk=0 in=0 ink=0 Rin=500Meg  ; pins IN+ IN- V+ V- OUT
R35 N052 N038 10K
R36 N052 N053 1Meg
R37 0 N038 1Meg
C9 N053 0 0.1µ
XU13 N052 N044 +5 -5 N048 level.2 Avol=1Meg GBW=10Meg Slew=10Meg ilimit=25m rail=0 Vos=0 phimargin=45 en=0 enk=0 in=0 ink=0 Rin=500Meg  ; pins IN+ IN- V+ V- OUT
R52 +5 N044 65K
R53 N044 -5 100K
C10 N049 N048 0.001µ
R54 N049 0 100K
D8 N049 N050 D
XU14 N050 N037 +5 -5 N045 level.2 Avol=1Meg GBW=10Meg Slew=10Meg ilimit=25m rail=0 Vos=0 phimargin=45 en=0 enk=0 in=0 ink=0 Rin=500Meg  ; pins IN+ IN- V+ V- OUT
R55 N045 N050 0.1Meg
R56 N050 0 400K
R57 N045 N037 150K
C11 N037 0 40n
D9 0 N037 D
C12 N046 N045 0.001µ
D10 N046 N047 D
R58 N046 0 100K
XU15 N047 N035 +5 -5 N036 level.2 Avol=1Meg GBW=10Meg Slew=10Meg ilimit=25m rail=0 Vos=0 phimargin=45 en=0 enk=0 in=0 ink=0 Rin=500Meg  ; pins IN+ IN- V+ V- OUT
R59 N036 N047 0.1Meg
R60 N047 0 100K
R61 N036 N035 150K
C13 N035 0 20n
D11 0 N035 D
D12 N045 N059 D
R62 N058 N059 1.5Meg
XU16 0 N058 +5 -5 N033 level.2 Avol=1Meg GBW=10Meg Slew=10Meg ilimit=25m rail=0 Vos=0 phimargin=45 en=0 enk=0 in=0 ink=0 Rin=500Meg  ; pins IN+ IN- V+ V- OUT
R63 N033 N058 1Meg
R64 N033 N053 15K
D13 N036 N043 D
R65 Tpre N043 12K
R66 Tpre 0 25K
XU17 N021 N012 +5 -5 Tpre1 level.2 Avol=1Meg GBW=10Meg Slew=10Meg ilimit=25m rail=0 Vos=0 phimargin=45 en=0 enk=0 in=0 ink=0 Rin=500Meg  ; pins IN+ IN- V+ V- OUT
R67 N012 0 100K
R68 Tpre1 N012 100K
XU18 N007 N005 +5 -5 Tpre1 level.2 Avol=1Meg GBW=10Meg Slew=10Meg ilimit=25m rail=0 Vos=0 phimargin=45 en=0 enk=0 in=0 ink=0 Rin=500Meg  ; pins IN+ IN- V+ V- OUT
R69 N005 0 100K
R70 Tpre1 N005 100K
XU19 N003 N001 +5 -5 Tpre1 level.2 Avol=1Meg GBW=10Meg Slew=10Meg ilimit=25m rail=0 Vos=0 phimargin=45 en=0 enk=0 in=0 ink=0 Rin=500Meg  ; pins IN+ IN- V+ V- OUT
R72 N001 0 100K
R73 Tpre1 N001 100K
XU20 N022 N013 +5 -5 Tpost1 level.2 Avol=1Meg GBW=10Meg Slew=10Meg ilimit=25m rail=0 Vos=0 phimargin=45 en=0 enk=0 in=0 ink=0 Rin=500Meg  ; pins IN+ IN- V+ V- OUT
R74 N013 0 100K
R75 Tpost1 N013 100K
XU21 N008 N006 +5 -5 Tpost1 level.2 Avol=1Meg GBW=10Meg Slew=10Meg ilimit=25m rail=0 Vos=0 phimargin=45 en=0 enk=0 in=0 ink=0 Rin=500Meg  ; pins IN+ IN- V+ V- OUT
R76 N006 0 100K
R77 Tpost1 N006 100K
XU22 N004 N002 +5 -5 Tpost1 level.2 Avol=1Meg GBW=10Meg Slew=10Meg ilimit=25m rail=0 Vos=0 phimargin=45 en=0 enk=0 in=0 ink=0 Rin=500Meg  ; pins IN+ IN- V+ V- OUT
R78 N002 0 100K
R79 Tpost1 N002 100K
V6 N003 0 PULSE(0 3 0 0 0 2m 9m)
V7 N007 0 PULSE(0 0 0 0 0 2m 10.2m)
V8 N021 0 PULSE(0 3 0 0 0 2m 10.9m)
V9 N004 0 PULSE(0 3 0 0 0 2m 10.6m)
V10 N008 0 PULSE(0 3 0 0 0 2m 10.8m)
V11 N022 0 PULSE(0 3 0 0 0 2m 10.3m)
V12 NC_02 0 PULSE(0 3 0 0 0 0.4m 1.2m)
R80 N074 Tpost1 10K
XU23 N074 N064 +5 -5 N073 level.2 Avol=1Meg GBW=10Meg Slew=10Meg ilimit=25m rail=0 Vos=0 phimargin=45 en=0 enk=0 in=0 ink=0 Rin=500Meg  ; pins IN+ IN- V+ V- OUT
R81 N073 N064 10K
R82 N073 N074 1Meg
R83 0 N064 1Meg
C14 N074 0 0.1µ
XU24 N073 N066 +5 -5 N070 level.2 Avol=1Meg GBW=10Meg Slew=10Meg ilimit=25m rail=0 Vos=0 phimargin=45 en=0 enk=0 in=0 ink=0 Rin=500Meg  ; pins IN+ IN- V+ V- OUT
R84 +5 N066 65K
R85 N066 -5 100K
C15 N071 N070 0.001µ
R86 N071 0 100K
D14 N071 N072 D
XU25 N072 N063 +5 -5 N067 level.2 Avol=1Meg GBW=10Meg Slew=10Meg ilimit=25m rail=0 Vos=0 phimargin=45 en=0 enk=0 in=0 ink=0 Rin=500Meg  ; pins IN+ IN- V+ V- OUT
R87 N067 N072 0.1Meg
R88 N072 0 400K
R89 N067 N063 150K
C16 N063 0 40n
D15 0 N063 D
C17 N068 N067 0.001µ
D16 N068 N069 D
R90 N068 0 100K
XU26 N069 N061 +5 -5 N062 level.2 Avol=1Meg GBW=10Meg Slew=10Meg ilimit=25m rail=0 Vos=0 phimargin=45 en=0 enk=0 in=0 ink=0 Rin=500Meg  ; pins IN+ IN- V+ V- OUT
R91 N062 N069 0.1Meg
R92 N069 0 100K
R93 N062 N061 150K
C18 N061 0 20n
D17 0 N061 D
D18 N067 N076 D
R94 N075 N076 1.5Meg
XU27 0 N075 +5 -5 N060 level.2 Avol=1Meg GBW=10Meg Slew=10Meg ilimit=25m rail=0 Vos=0 phimargin=45 en=0 enk=0 in=0 ink=0 Rin=500Meg  ; pins IN+ IN- V+ V- OUT
R95 N060 N075 1Meg
R96 N060 N074 15K
D19 N062 N065 D
R97 Tpost N065 12K
R98 Tpost 0 25K
.model D D
.lib standard.dio
.model NPN NPN
.model PNP PNP
.lib standard.bjt
.tran 0 15 0 1000u
.lib UniversalOpamps2.sub
.backanno
.end